# Altium schematic sheet 12V_For_Bucks.SchDoc
size A; SheetNumber: 4; SheetTotal: 9
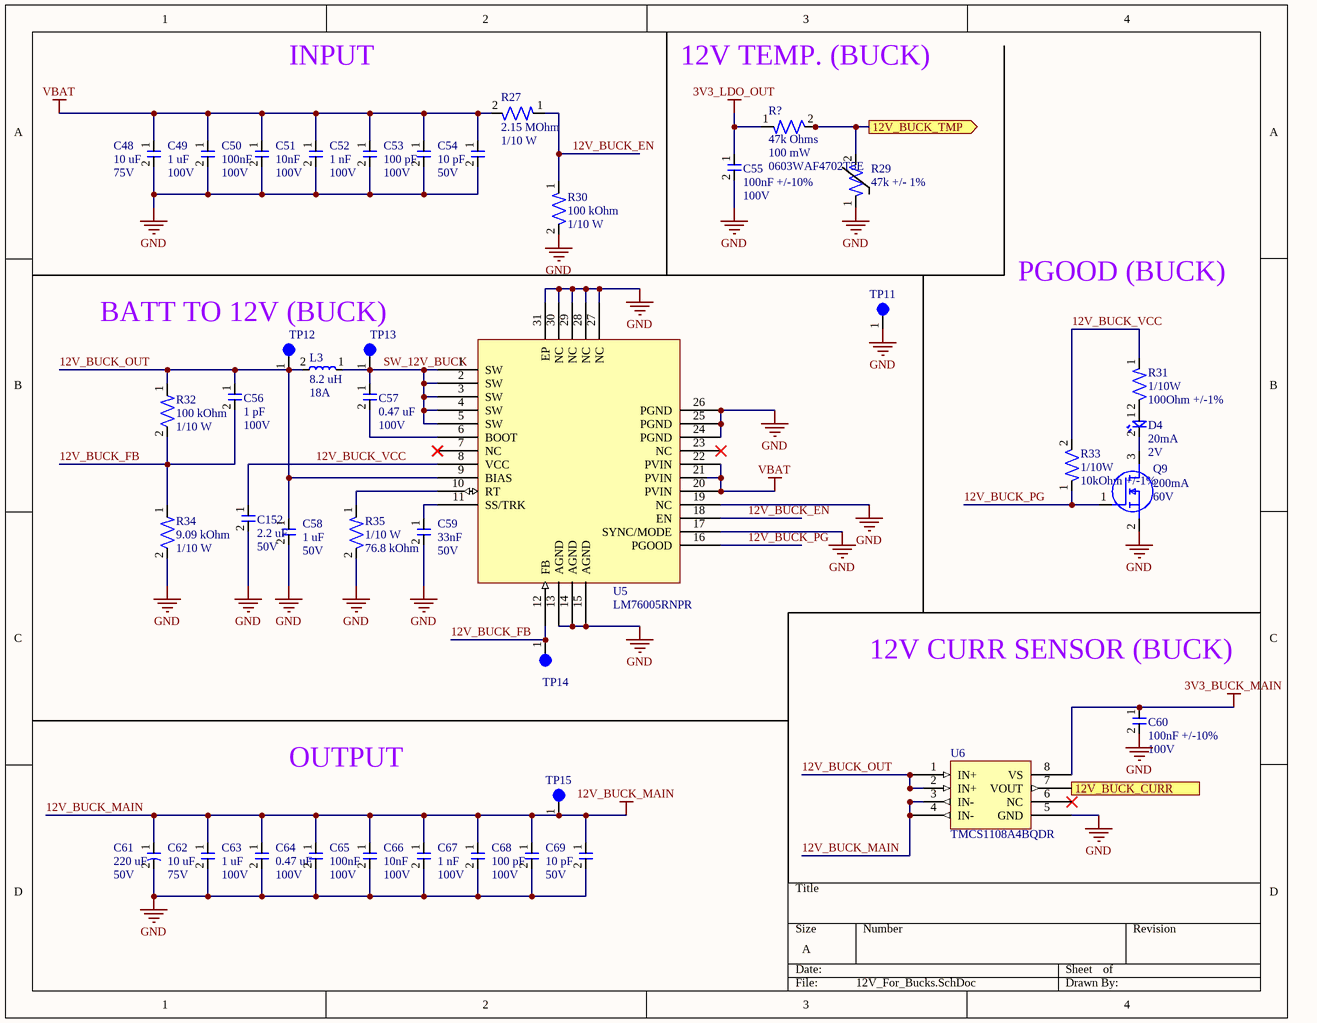
[diagram p0: 12V_For_Bucks.SchDoc]

## Parts
C48  Capacitance: 10 uF  Voltage Rating: 75V  [CAP-1210]  (hidden comment: C3225X7R1N106K250AC)
C49  Capacitance: 1 uF  Voltage: 100V  [CAP-1206 - duplicate]  (hidden comment: CL31B105KCHNNNE)
C50  Capacitance: 100nF  Voltage Rating: 100V  [CAP-0603]  (hidden comment: CC0603KRX7R0BB104)
C51  Capacitance: 10nF  Voltage Rating: 100V  [CAP-0603]  (hidden comment: C1608C0G2A103J080AC)
C52  Capacitance: 1 nF  Voltage: 100V  [CAP-0603]  (hidden comment: C0603Y102K1RAC7867)
C53  Capacitance: 100 pF  Voltage: 100V  [CAP-0603]  (hidden comment: 0603N101J101CT)
C54  Capacitance: 10 pF  Voltage Rating: 50V  [CAP-0603]  (hidden comment: 0603N100J500CT)
C55  Capacitance: 100nF +/-10%  Voltage Rating: 100V  [CAP-0603]  (hidden comment: CC0603KRX7R0BB104)
C56  Capacitance: 1 pF  Voltage: 100V  [CAP-0603]  (hidden comment: 885012006087)
C57  Capacitance: 0.47 uF  Voltage: 100V  [CAP-0805]  (hidden comment: KAM21KR72A474KL)
C58  Capacitance: 1 uF  Voltage: 50V  [CAP-0603]  (hidden comment: UMK107AB7105KA-T)
C59  Capacitance: 33nF  Voltage Rating: 50V  [CAP-0603]  (hidden comment: CC0603KRX7R9BB333)
C60  Capacitance: 100nF +/-10%  Voltage Rating: 100V  [CAP-0603]  (hidden comment: CC0603KRX7R0BB104)
C61  Capacitance: 220 uF  Voltage Rating: 50V  [ELEC-220U-0003]  (hidden comment: 50TZV220M10X10.5)
C62  Capacitance: 10 uF  Voltage Rating: 75V  [CAP-1210]  (hidden comment: C3225X7R1N106K250AC)
C63  Capacitance: 1 uF  Voltage: 100V  [CAP-1206 - duplicate]  (hidden comment: CL31B105KCHNNNE)
C64  Capacitance: 0.47 uF  Voltage: 100V  [CAP-0805]  (hidden comment: KAM21KR72A474KL)
C65  Capacitance: 100nF  Voltage Rating: 100V  [CAP-0603]  (hidden comment: CC0603KRX7R0BB104)
C66  Capacitance: 10nF  Voltage Rating: 100V  [CAP-0603]  (hidden comment: C1608C0G2A103J080AC)
C67  Capacitance: 1 nF  Voltage: 100V  [CAP-0603]  (hidden comment: C0603Y102K1RAC7867)
C68  Capacitance: 100 pF  Voltage: 100V  [CAP-0603]  (hidden comment: 0603N101J101CT)
C69  Capacitance: 10 pF  Voltage Rating: 50V  [CAP-0603]  (hidden comment: 0603N100J500CT)
C152  Capacitance: 2.2 uF  oltage: 50V  [CAP-0603]  (hidden comment: UMK107BBJ225KA-T)
D4  Current Rating: 20mA  Vf: 2V  [LED-0603]  (hidden comment: 150060AS75000)
L3  Inductance: 8.2 uH  DCI: 18A  [PWRIND-8.2U-0002]  (hidden comment: IHLP6767GZER8R2M01)
Q9  Id-Continuous: 200mA  VDS-Max: 60V  [NMOS-SOT23-3]  (hidden comment: T2N7002AK,LM)
R27  Resistance: 2.15 MOhm  Power: 1/10 W  [RES-0603]  (hidden comment: RC0603FR-072M15L)
R29  Resistance: 47k +/- 1%  [RES-0402]  (hidden comment: TMP6431DECR)
R30  Resistance: 100 kOhm  Power: 1/10 W  [RES-0603]  (hidden comment: RC0603FR-07100KL)
R31  Power Rating: 1/10W  Resistance: 100Ohm +/-1%  [RES-0603]  (hidden comment: AC0603FR-10100RL)
R32  Resistance: 100 kOhm  Power: 1/10 W  [RES-0603]  (hidden comment: RC0603FR-07100KL)
R33  Power Rating: 1/10W  Resistance: 10kOhm +/-1%  [RES-0603]  (hidden comment: RC0603FR-0710KP)
R34  Resistance: 9.09 kOhm  Power: 1/10 W  [RES-0603]  (hidden comment: RC0603FR-079K09L)
R35  Power: 1/10 W  Resistance: 76.8 kOhm  [RES-0603]  (hidden comment: RC0603FR-0776K8L)
R?  0603WAF4702T5E  [RES-0603]
TP11  5003  [TEST-POINT-0001]  (value not drawn)
TP12  5003  [TEST-POINT-0001]  (value not drawn)
TP13  5003  [TEST-POINT-0001]  (value not drawn)
TP14  5003  [TEST-POINT-0001]  (value not drawn)
TP15  5003  [TEST-POINT-0001]  (value not drawn)
U5  LM76005RNPR  [IC-30-WQFN(6x4)]
U6  TMCS1108A4BQDR  [IC-CURRENT-0001]

## Ports
12V_BUCK_CURR (out, see can-stm32g4[1D]), 12V_BUCK_TMP (out, see can-stm32g4[1D])

## Nets
3V3_BUCK_MAIN: C60.1 U6.8(VS)
3V3_LDO_OUT: C55.1 R?.1
12V_BUCK_MAIN: C61.1 C62.1 C63.1 C64.1 C65.1 C66.1 C67.1 C68.1 C69.1 TP15.1 U6.3(IN-) U6.4(IN-)
GND: C48.2 C49.2 C50.2 C51.2 C52.2 C53.2 C54.2 C55.2 C58.2 C59.2 C60.2 C61.2 C62.2 C63.2 C64.2 C65.2 C66.2 C67.2 C68.2 C69.2 C152.2 Q9.2(S) R29.1 R30.2 R34.2 R35.2 TP11.1 U5.13(AGND) U5.14(AGND) U5.15(AGND) U5.17(SYNC/MODE) U5.19(NC) U5.24(PGND) U5.25(PGND) U5.26(PGND) U5.27(NC) U5.28(NC) U5.29(NC) U5.30(NC) U5.31(EP) U6.5(GND)
VBAT: C48.1 C49.1 C50.1 C51.1 C52.1 C53.1 C54.1 R27.2 U5.20(PVIN) U5.21(PVIN) U5.22(PVIN)
12V_BUCK_CURR: U6.7(VOUT) ; port 12V_BUCK_CURR
12V_BUCK_EN: R27.1 R30.1 U5.18(EN)
12V_BUCK_FB: C56.2 R32.2 R34.1 TP14.1 U5.12(FB)
12V_BUCK_OUT: C56.1 C58.1 L3.2 R32.1 TP12.1 U5.9(BIAS) U6.1(IN+) U6.2(IN+)
12V_BUCK_PG: Q9.1(G) R33.1 U5.16(PGOOD)
12V_BUCK_TMP: R29.2 R?.2 ; port 12V_BUCK_TMP
12V_BUCK_VCC: C152.1 R31.1 R33.2 U5.8(VCC)
SW_12V_BUCK: C57.1 L3.1 TP13.1 U5.1(SW) U5.2(SW) U5.3(SW) U5.4(SW) U5.5(SW)
NetC57_2: C57.2 U5.6(BOOT)
NetC59_1: C59.1 U5.11(SS/TRK)
NetD4_1: D4.1 R31.2
NetD4_2: D4.2 Q9.3(D)
NetR35_1: R35.1 U5.10(RT)

Not connected (* = marked no-connect by the designer): U5 7(NC)* 23(NC)*; U6 6(NC)*

## Notes on the sheet
- INPUT
- 12V TEMP. (BUCK)
- PGOOD (BUCK)
- BATT TO 12V (BUCK)
- (near C60) 12V CURR SENSOR (BUCK)
- OUTPUT
- (in symbol RES-47k-0001-JLC) 47k Ohms; 100 mW

## Library data of the parts
C48 C62 = CAP-10U-0004: 10 µF ±10% 75V Ceramic Capacitor X7R 1210 (3225 Metric)
C49 C63 = CAP-1U-0001: 1 µF ±10% 100V Ceramic Capacitor X7R 1206 (3216 Metric)
C50 C55 C60 C65 = CAP-100N-0001: CAP CER 0.1UF 100V X7R 0603; Manufacturer: YAGEO; Assembled?: no; Manufacturer Part Number: CC0603KRX7R0BB104; Temperature Coefficient: X7R; Package Size: 0603
C51 C66 = CAP-10N-0002: CAP CER 10000PF 100V C0G 0603; Manufacturer: TDK Corporation; Temperature Coefficient: C0G/NP0; Assembled?: no; Manufacturer Part Number: C1608C0G2A103J080AC; Package Size: 0603
C52 C67 = CAP-1N-0001: 1000 pF ±10% 100V Ceramic Capacitor X7R 0603 (1608 Metric)
C53 C68 = CAP-100P-0002: 100 pF ±5% 100V Ceramic Capacitor C0G, NP0 0603 (1608 Metric); Tolerance: +/-5%; Temp Coeff: C0G/NP0; Package Size: 0603
C54 C69 = CAP-10P-0001: 10 pF ±5% 50V Ceramic Capacitor C0G, NP0 0603 (1608 Metric); Manufacturer: Walshin Technology Corporation; Assembled?: Yes; Manufacturer Part Number: 0603N100J500CT; Temperature Coefficient: C0G, NP0; Package Size: 0603
C56 = CAP-1P-0001: 1 pF ±0.25pF 100V Ceramic Capacitor C0G, NP0 0603 (1608 Metric); Tolerance: +/- 0.25 pF; Temperature Coefficient: C0G/NP0; Assembled?: No; Package Size: 0603
C57 C64 = CAP-0.47U-0001: 0.47 µF ±10% 100V Ceramic Capacitor X7R 0805 (2012 Metric); Tolerance: +/- 10%; Assembled?: No; Temperature Coefficient: X7R; Package Size: 0805
C58 = CAP-1U-0002: 1 µF ±10% 50V Ceramic Capacitor X7R 0603 (1608 Metric); Package Size: 0603
C59 = CAP-33N-0001: 0.033 µF ±10% 50V Ceramic Capacitor X7R 0603 (1608 Metric); Manufacturer: YAGEO; Assembled?: no; Manufacturer Part Number: CC0603KRX7R9BB333; Temperature Coefficient: X7R; Package Size: 0603
C61 = ELEC-220U-0003: 220 µF 50 V Aluminum Electrolytic Capacitors Radial, Can - SMD 2000 Hrs @ 105°C; Size: .406inx.406in*.413in
C152 = CAP-2.2U-0001: 2.2 µF ±10% 50V Ceramic Capacitor X5R 0603 (1608 Metric)
D4 = LED_Amber_0001: CAP CER 0.1UF 100V X7R 0603; Manufacturer: Wurth Electronik; Assembled?: no; Color: Amber; Manufacturer Part Number: 150060AS75000; Package Size: 0603
L3 = PWRIND-8.2U-0002: 8.2 µH Shielded Molded Inductor 18 A 10.66mOhm Max Nonstandard; Isat: 25A; Tolerance: +/-20%; DCR: 10.66 mOhm
Q9 = NMOS-200MA-0001: MOSFET N-CH 60V 200MA SOT23; Manufacturer: Toshiba; FET type: N-Channel; Rds On-Max: 3.9Ohm; Vgs-Max: 20V; Assembled?: no; Manufacturer Part Number: T2N7002AK,LM; Package: SOT-23-3
R27 = RES-2.15M-0001: 2.15 MOhms ±1% 0.1W, 1/10W Chip Resistor 0603 (1608 Metric) Moisture Resistant Thick Film; Tolerance: +/-1%; Assembled?: No; Package Size: 0603
R29 = THERM-47K-0001: PTC Thermistor 47 kOhms 0402 (1006 Metric); Manufacturer: Texas Instruments; Manufacturer Part Number: TMP6431DECR; Package Size: 0402
R30 R32 = RES-100K-0003: 100 kOhms ±1% 0.1W, 1/10W Chip Resistor 0603 (1608 Metric) Moisture Resistant Thick Film; Tolerance: +/- 1%; Assembled?: No; Package Size: 0603
R31 = RES-100-0002: 100 Ohms ±1% 0.1W, 1/10W Chip Resistor 0603 (1608 Metric) Automotive AEC-Q200 Thick Film; Manufacturer: YAGEO; Assembled?: no; Manufacturer Part Number: AC0603FR-10100RL; Package Size: 0603
R33 = RES-10K-0002: RES SMD 10K OHM 1% 1/10W 0603; Manufacturer: YAGEO; Assembled?: no; Manufacturer Part Number: RC0603FR-0710KP; Package Size: 0603
R34 = RES-9.09K-0001: 9.09 kOhms ±1% 0.1W, 1/10W Chip Resistor 0603 (1608 Metric) Moisture Resistant Thick Film; Tolerance: +/-1%; Assembled?: No; Package Size: 0603
R35 = RES-76.8K-0001: 76.8 kOhms ±1% 0.1W, 1/10W Chip Resistor 0603 (1608 Metric) Moisture Resistant Thick Film; Manufacturer: Yageo; Tolerance: +/- 1%; Package Size: 0603
R? = RES-47k-0001-JLC: 100mW Thick Film Resistors 75V ±100ppm/℃ ±1% 47kΩ 0603 Chip Resistor - Surface Mount ROHS; Resistance: 47kOhms; Power: 100mW
TP11-TP15 = TEST-POINT-0001: Oranange PC Test Point, Miniature Phoisphor Bronze Silver Plating Through Hole Mounting Type
U5 = IC-BUCK-0006: Buck Switching Regulator IC Positive Adjustable 1V 1 Output 5A 30-WFQFN Exposed Pad; Manufacturer: Texas Instruments; Assembled?: no; Manufacturer Part Number: LM76005RNPR; Type: Buck; Package: 30-WFQFN; Current: LM76005RNPR
U6 = IC-CURRENT-0004: Current Sensor 1 Channel Hall Effect Bidirectional 8-SOIC (0.154", 3.90mm Width); Assembled?: No; Supply Voltage: 5V; Footprint: 8-SOIC